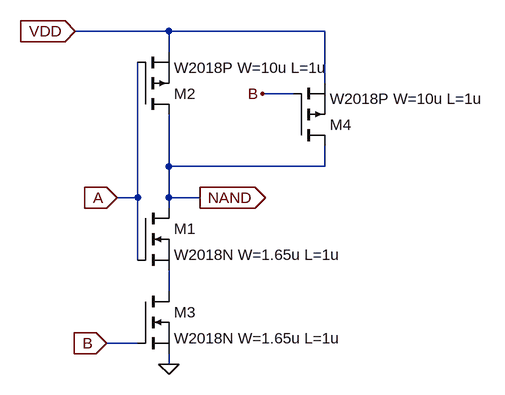
[diagram p0: schematic NAND.asc]
NAND.asc, the LTspice schematic file:
Version 4
SHEET 1 880 680
WIRE 256 16 112 16
WIRE 496 16 256 16
WIRE 256 48 256 16
WIRE 496 96 496 16
WIRE 448 112 400 112
WIRE 256 224 256 144
WIRE 496 224 496 192
WIRE 496 224 256 224
WIRE 208 272 208 64
WIRE 208 272 176 272
WIRE 256 272 256 224
WIRE 304 272 256 272
WIRE 256 288 256 272
WIRE 208 368 208 272
WIRE 256 416 256 384
WIRE 208 496 160 496
WIRE 256 528 256 512
FLAG 256 528 0
FLAG 112 16 VDD
IOPIN 112 16 In
FLAG 176 272 A
IOPIN 176 272 In
FLAG 304 272 NAND
IOPIN 304 272 Out
FLAG 400 112 B
FLAG 160 496 B
IOPIN 160 496 In
SYMBOL nmos 208 288 R0
SYMATTR InstName M1
SYMATTR Value W2018N W=1.65u L=1u
SYMBOL pmos 208 144 M180
SYMATTR InstName M2
SYMATTR Value W2018P W=10u L=1u
SYMBOL nmos 208 416 R0
SYMATTR InstName M3
SYMATTR Value W2018N W=1.65u L=1u
SYMBOL pmos 448 192 M180
SYMATTR InstName M4
SYMATTR Value W2018P W=10u L=1u

The netlist it stands for:
* NAND.asc
M1 NAND A N001 N001 W2018N W=1.65u L=1u
M2 NAND A VDD VDD W2018P W=10u L=1u
M3 N001 B 0 0 W2018N W=1.65u L=1u
M4 NAND B VDD VDD W2018P W=10u L=1u
.model NMOS NMOS
.model PMOS PMOS
.lib standard.mos
.backanno
.end